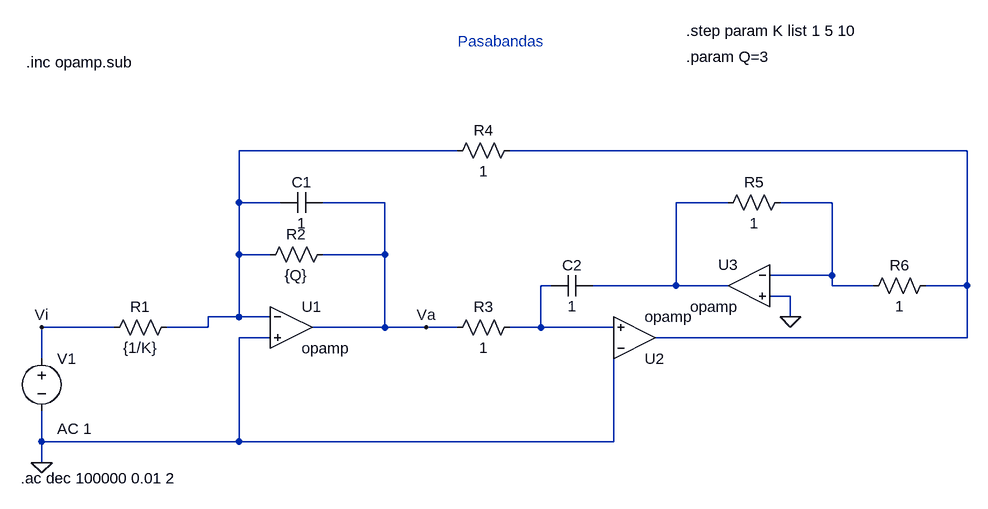
[diagram p0: schematic TPS2_Butterworth.asc]
TPS2_Butterworth.asc, the LTspice schematic file:
Version 4
SHEET 1 1360 680
WIRE 544 -96 208 -96
WIRE 1328 -96 624 -96
WIRE 208 -16 208 -96
WIRE 272 -16 208 -16
WIRE 432 -16 336 -16
WIRE 960 -16 880 -16
WIRE 1120 -16 1040 -16
WIRE 208 64 208 -16
WIRE 256 64 208 64
WIRE 432 64 432 -16
WIRE 432 64 336 64
WIRE 1120 96 1120 -16
WIRE 1120 96 1024 96
WIRE 688 112 672 112
WIRE 880 112 880 -16
WIRE 880 112 752 112
WIRE 960 112 880 112
WIRE 1120 112 1120 96
WIRE 1184 112 1120 112
WIRE 1328 112 1328 -96
WIRE 1328 112 1264 112
WIRE 1056 128 1024 128
WIRE 208 160 208 64
WIRE 208 160 160 160
WIRE 256 160 208 160
WIRE 1056 160 1056 128
WIRE 16 176 -96 176
WIRE 160 176 160 160
WIRE 160 176 96 176
WIRE 432 176 432 64
WIRE 432 176 320 176
WIRE 496 176 432 176
WIRE 544 176 496 176
WIRE 672 176 672 112
WIRE 672 176 624 176
WIRE 784 176 672 176
WIRE 256 192 208 192
WIRE 1328 192 1328 112
WIRE 1328 192 848 192
WIRE -96 224 -96 176
WIRE -96 352 -96 304
WIRE 208 352 208 192
WIRE 208 352 -96 352
WIRE 784 352 784 208
WIRE 784 352 208 352
WIRE -96 384 -96 352
FLAG 1056 160 0
FLAG -96 384 0
FLAG -96 176 Vi
FLAG 496 176 Va
SYMBOL voltage -96 208 R0
WINDOW 123 24 124 Left 2
WINDOW 39 0 0 Left 0
SYMATTR Value2 AC 1
SYMATTR InstName V1
SYMATTR Value ""
SYMBOL res 112 160 R90
WINDOW 0 0 56 VBottom 2
WINDOW 3 32 56 VTop 2
SYMATTR InstName R1
SYMATTR Value {1/K}
SYMBOL res 352 48 R90
WINDOW 0 0 56 VBottom 2
WINDOW 3 32 56 VTop 2
SYMATTR InstName R2
SYMATTR Value {Q}
SYMBOL res 640 160 R90
WINDOW 0 0 56 VBottom 2
WINDOW 3 32 56 VTop 2
SYMATTR InstName R3
SYMATTR Value 1
SYMBOL res 640 -112 R90
WINDOW 0 0 56 VBottom 2
WINDOW 3 32 56 VTop 2
SYMATTR InstName R4
SYMATTR Value 1
SYMBOL res 1056 -32 R90
WINDOW 0 0 56 VBottom 2
WINDOW 3 32 56 VTop 2
SYMATTR InstName R5
SYMATTR Value 1
SYMBOL res 1280 96 R90
WINDOW 0 0 56 VBottom 2
WINDOW 3 32 56 VTop 2
SYMATTR InstName R6
SYMATTR Value 1
SYMBOL cap 336 -32 R90
WINDOW 0 0 32 VBottom 2
WINDOW 3 32 32 VTop 2
SYMATTR InstName C1
SYMATTR Value 1
SYMBOL cap 752 96 R90
WINDOW 0 0 32 VBottom 2
WINDOW 3 32 32 VTop 2
SYMATTR InstName C2
SYMATTR Value 1
SYMBOL OpAmps\\opamp 288 112 R0
SYMATTR InstName U1
SYMBOL OpAmps\\opamp 816 256 M180
SYMATTR InstName U2
SYMBOL OpAmps\\opamp 992 48 M0
SYMATTR InstName U3
TEXT -120 -232 Left 2 !.inc opamp.sub
TEXT -128 408 Left 2 !.ac dec 100000 0.01 2
TEXT 896 -280 Left 2 !.step param K list 1 5 10
TEXT 896 -240 Left 2 !.param Q=3
TEXT 544 -264 Left 2 ;Pasabandas

The netlist it stands for:
* TPS2_Butterworth.asc
V1 Vi 0 AC 1
R1 N001 Vi {1/K}
R2 Va N001 {Q}
R3 N005 Va 1
R4 N002 N001 1
R5 N004 N003 1
R6 N002 N004 1
C1 Va N001 1
C2 N003 N005 1
XU1 N001 0 Va opamp Aol=100K GBW=10Meg  ; pins invin noninvin out
XU2 0 N005 N002 opamp Aol=100K GBW=10Meg  ; pins invin noninvin out
XU3 N004 0 N003 opamp Aol=100K GBW=10Meg  ; pins invin noninvin out
.inc opamp.sub
.ac dec 100000 0.01 2
.step param K list 1 5 10
.param Q=3
* Pasabandas
.backanno
.end